# Altium project USB Dongle.PrjPcb
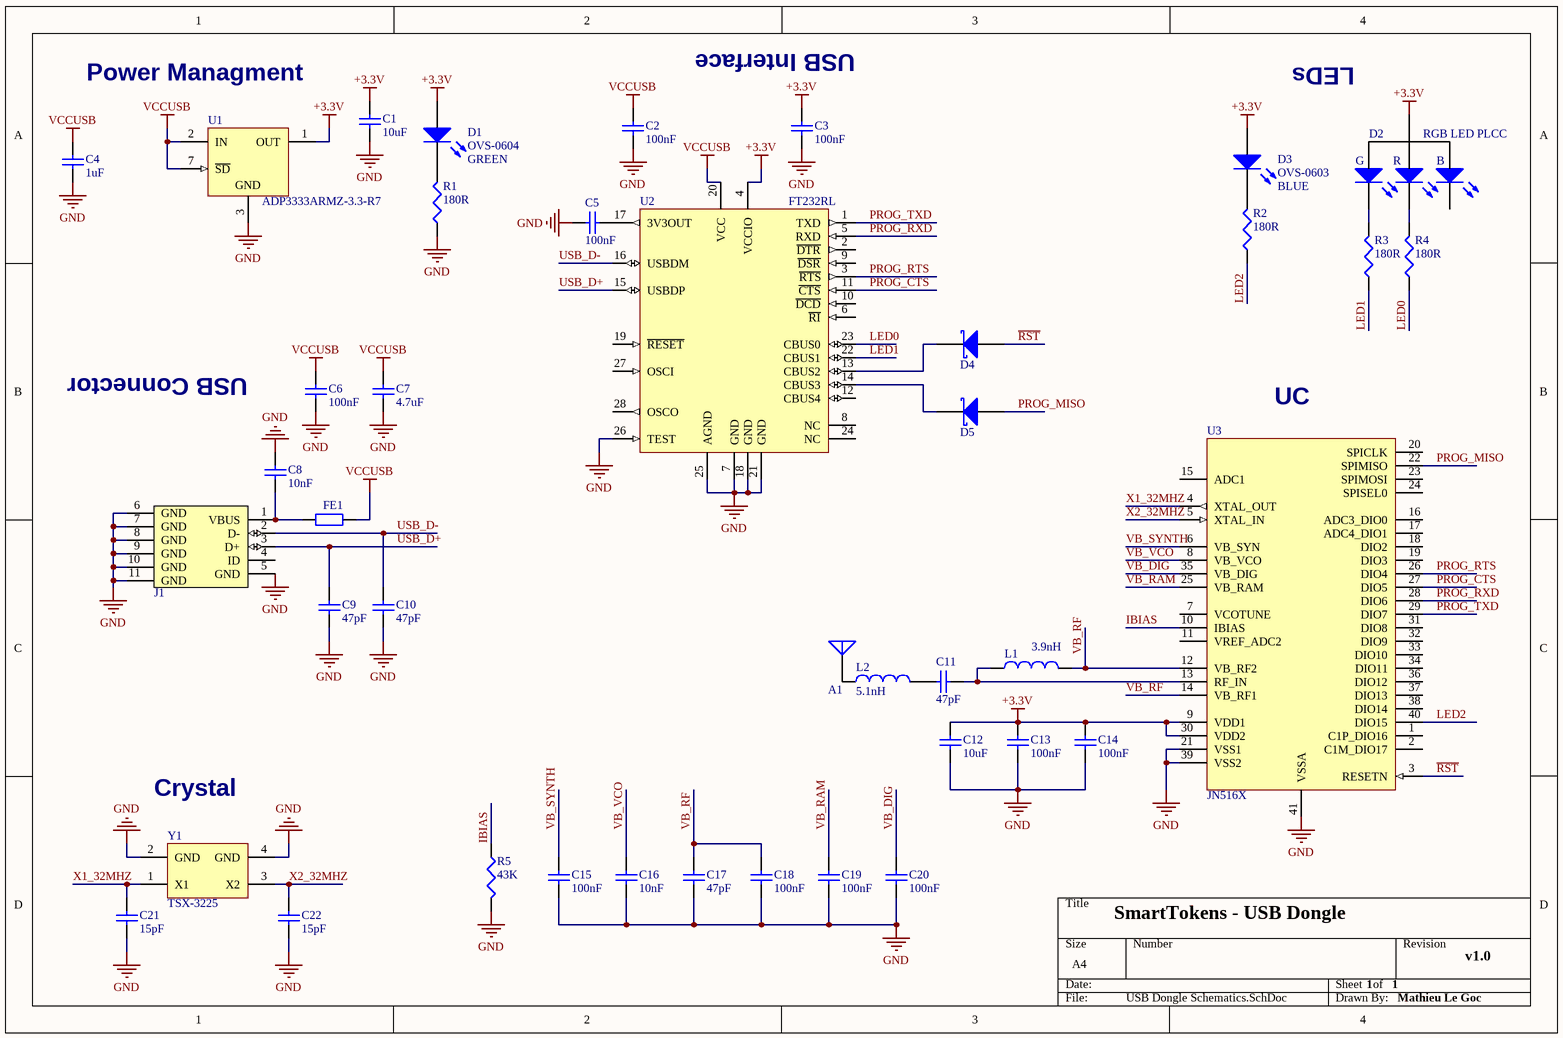
[diagram p0: USB Dongle Schematics.SchDoc]
1 sheet, 41 parts. Net scope: global (net labels, ports and power ports of the same name join across sheets).
Board file: USB Dongle PCB.PcbDoc

## Sheet USB Dongle Schematics.SchDoc: SmartTokens - USB Dongle
size A4; Author: Mathieu Le Goc; DocumentNumber: 1; Revision: v1.0; SheetNumber: 1; SheetTotal: 1; PageSetup: Record=PageOptions|CenterHorizontal=True|CenterVertical=True|PrintScale=1.04|XCorrection=1.00|YCorrection=1.00|PrintKind=1|BorderSize=5000000|LeftOffset=0|BottomOffset=0|Orientation=2|PaperLength=1000|PaperWidth=1000|Scale=100|PaperSource=7|PrintQuality=-4|MediaType=1|DitherType=10|PrintScaleMode=1|PaperKind=A4|PaperIndex=9

### Parts
A1  2450AT18A100  [2450AT18A100]  (value not drawn)
C1  value 10uF  [0603]  (hidden comment: 10uF 0603 X5R 6.3V AVX)
C2  value 100nF  [0402]  (hidden comment: 100nF 0402 X7R 16V ±10%)
C3  value 100nF  [0402]  (hidden comment: 100nF 0402 X7R 16V ±10%)
C4  value 1uF  [0603]  (hidden comment: 1uF 0603 X5R 10V MULTICOMP)
C5  value 100nF  [0402]  (hidden comment: 100nF 0402 X7R 16V ±10%)
C6  value 100nF  [0402]  (hidden comment: 100nF 0402 X7R 16V ±10%)
C7  value 4.7uF  [0603]  (hidden comment: 4.7uF 0603 X5R 10V KEMET)
C8  value 10nF  [0402]  (hidden comment: 10nF 0402 X7R 25V KEMET)
C9  value 47pF  [0402]  (hidden comment: 47pF 0402 NP0 50V MURATA)
C10  value 47pF  [0402]  (hidden comment: 47pF 0402 NP0 50V MURATA)
C11  value 47pF  [0402]  (hidden comment: 47pF 0402 NP0 50V ±5%)
C12  value 10uF  [0603]  (hidden comment: 10uF 0603 X5R 6.3V ±20%)
C13  value 100nF  [0402]  (hidden comment: 100nF 0402 X7R 16V ±10%)
C14  value 100nF  [0402]  (hidden comment: 100nF 0402 X7R 16V ±10%)
C15  value 100nF  [0402]  (hidden comment: 100nF 0402 X7R 16V ±10%)
C16  10nF  [0402]
C17  value 47pF  [0402]  (hidden comment: 47pF 0402 NP0 50V ±5%)
C18  value 100nF  [0402]  (hidden comment: 100nF 0402 X7R 16V ±10%)
C19  value 100nF  [0402]  (hidden comment: 100nF 0402 X7R 16V ±10%)
C20  value 100nF  [0402]  (hidden comment: 100nF 0402 X7R 16V ±10%)
C21  value 15pF  [0402]  (hidden comment: 15pF 0402 NP0 50V ±5%)
C22  value 15pF  [0402]  (hidden comment: 15pF 0402 NP0 50V ±5%)
D1  OVS-0604  value GREEN  [0603 - LED]
D2  RGB LED PLCC  [PLCC_4]
D3  OVS-0603  value BLUE  [0603 - LED]
D4  Schottky barrier single diode  [SOD-323]  (value not drawn)
D5  Schottky barrier single diode  [SOD-323]  (value not drawn)
FE1  MURATA - BLM18PG471SN1D  [0603]  (value not drawn)
J1  MICRO USB B  [MICRO_USB_B]  (value not drawn)
L1  value 3.9nH  [0402]  (hidden comment: 3.9NH  0402 MURATA)
L2  value 5.1nH  [0402]  (hidden comment: 5.1NH  0402 MURATA)
R1  value 180R  [0402]  (hidden comment: 180R 0402 1% VISHAY)
R2  value 180R  [0402]  (hidden comment: 180R 0402 1/16W ±1%)
R3  value 180R  [0402]  (hidden comment: 180R 0402 1/16W ±1%)
R4  value 180R  [0402]  (hidden comment: 180R 0402 1/16W ±1%)
R5  value 43K  [0402]  (hidden comment: 43K 0402 1/16W ±1%)
U1  ADP3333ARMZ-3.3-R7  [ADI-RM-8_N]
U2  FT232RL  [SSOP-28_N]
U3  JN516X  [QFN50P600X600X100_HS-41N]
Y1  TSX-3225  [TSX-3225]

### Nets
+3.3V: C1.2 C3.2 C12.2 C13.2 C14.2 D1.1(A) D2.3(A) D3.1(A) U1.1(OUT) U2.4(VCCIO) U3.9(VDD1) U3.30(VDD2)
GND: C1.1 C2.1 C3.1 C4.1 C5.2 C6.1 C7.1 C8.2 C9.1 C10.1 C12.1 C13.1 C14.1 C15.1 C16.1 C17.1 C18.1 C19.1 C20.1 C21.1 C22.1 J1.5(GND) J1.6(GND) J1.7(GND) J1.8(GND) J1.9(GND) J1.10(GND) J1.11(GND) R1.1 R5.2 U1.3(GND) U1.4(NC) U1.5(NC) U1.6(NC) U1.8(NC) U2.7(GND) U2.18(GND) U2.21(GND) U2.25(AGND) U2.26(TEST) U3.21(VSS1) U3.39(VSS2) U3.41(VSSA) Y1.2(GND) Y1.4(GND)
VCCUSB: C2.2 C4.2 C6.2 C7.2 FE1.2 U1.2(IN) U1.7(~{SD}) U2.20(VCC)
IBIAS: R5.1 U3.10(IBIAS)
LED0: R4.1 U2.23(CBUS0)
LED1: R3.1 U2.22(CBUS1)
LED2: R2.1 U3.40(DIO15)
PROG_CTS: U2.11(~{CTS}) U3.27(DIO5)
PROG_MISO: D5.2(A) U3.22(SPIMISO)
PROG_RTS: U2.3(~{RTS}) U3.26(DIO4)
PROG_RXD: U2.5(RXD) U3.28(DIO6)
PROG_TXD: U2.1(TXD) U3.29(DIO7)
~{RST}: D4.2(A) U3.3(RESETN)
USB_D+: C9.2 J1.3(D+) U2.15(USBDP)
USB_D-: C10.2 J1.2(D-) U2.16(USBDM)
VB_DIG: C20.2 U3.35(VB_DIG)
VB_RAM: C19.2 U3.25(VB_RAM)
VB_RF: C17.2 C18.2 L1.2 U3.12(VB_RF2) U3.14(VB_RF1)
VB_SYNTH: C15.2 U3.6(VB_SYN)
VB_VCO: C16.2 U3.8(VB_VCO)
X1_32MHZ: C21.2 U3.4(XTAL_OUT) Y1.1(X1)
X2_32MHZ: C22.2 U3.5(XTAL_IN) Y1.3(X2)
NetA1_1: A1.1(A) L2.1
NetC5_1: C5.1 U2.17(3V3OUT)
NetC8_1: C8.1 FE1.1 J1.1(VBUS)
NetC11_1: C11.1 L2.2
NetC11_2: C11.2 L1.1 U3.13(RF_IN)
NetD1_2: D1.2(K) R1.2
NetD2_1: D2.1(KR) R4.2
NetD2_2: D2.2(KG) R3.2
NetD3_2: D3.2(K) R2.2
NetD4_1: D4.1(K) U2.13(CBUS2)
NetD5_1: D5.1(K) U2.14(CBUS3)

Not connected (* = marked no-connect by the designer): D2 4(KB); J1 4(ID); U2 2(~{DTR}) 6(~{RI}) 8(NC) 9(~{DSR}) 10(~{DCD}) 12(CBUS4) 19(~{RESET}) 24(NC) 27(OSCI) 28(OSCO); U3 1(C1P_DIO16) 2(C1M_DIO17) 7(VCOTUNE) 11(VREF_ADC2) 15(ADC1) 16(ADC3_DIO0) 17(ADC4_DIO1) 18(DIO2) 19(DIO3) 20(SPICLK) 23(SPIMOSI) 24(SPISEL0) 31(DIO8) 32(DIO9) 33(DIO10) 34(DIO11) 36(DIO12) 37(DIO13) 38(DIO14)

### Notes on the sheet
- (near C3) USB Interface
- Power Managment
- LEDs
- USB Connector
- (near U3) UC
- Crystal
- (in symbol RGB_LED) G; R; B

### Library data of the parts
A1 = 2450AT18A100: JOHANSON TECHNOLOGY  2450AT18A100E  ANTENNA, CERAMIC, 2.45GHZ; Supplier 1: Farnell; Supplier Part Number 1: 1885496; Supplier 2: Digi-Key; Supplier Part Number 2: 712-1005-1-ND
C1 = 10uF 0603 X5R 6.3V: AVX - 06036D106MAT2A - 0603 X5R 6.3V 10UF; Supplier 1: Farnell; Supplier Part Number 1: 1833804
C2 C3 C5 C6 C13-C15 C18-C20 = 100nF (cheap): Supplier 1: Farnell; Supplier Part Number 1: 1288252; Supplier 2: Digi-Key; Supplier Part Number 2: 399-3521-1-ND
C4 = 1uF 0603 X5R 10V: MULTICOMP - MC0603X105K100CT - MLCC 0603 X5R 10V 1UF; Supplier 1: Farnell; Supplier Part Number 1: 1759399
C7 = 4.7uF 0603 X5R 10V: KEMET - C0603C475K8PACTU - CONDENSATEUR 4.7UF 10V X5R 0603; Supplier 1: Farnell; Supplier Part Number 1: 1572625
C8 = 10nF 0402 X7R 25V: KEMET - C0402C103J3RACTU - MLCC 0402 25V 0.01UF; Supplier 1: Farnell; Supplier Part Number 1: 1692285
C9 C10 = 47pF 0402 NP0 50V: MURATA - GRM1555C1H470JZ01D - 0402 47PF 50V; Supplier 1: Farnell; Supplier Part Number 1: 8819670
C11 C17 = 47pF: Supplier 1: Farnell; Supplier Part Number 1: 8819670; Supplier 2: Digi-Key; Supplier Part Number 2: 445-1243-1-ND
C12 = 10uF (cheap): Supplier 1: Farnell; Supplier Part Number 1: 1833804; Supplier 2: Digi-Key; Supplier Part Number 2: 478-5318-1-ND
C16 = 10nF: 10nF 0402 X7R 25V ±5%; Supplier 1: Farnell; Supplier Part Number 1: 1692285; Supplier 2: Digi-Key; Supplier Part Number 2: 399-1279-1-ND; Value: 10nF
C21 C22 = 15pF: Supplier 1: Farnell; Supplier Part Number 1: 1414577; Supplier 2: Digi-Key; Supplier Part Number 2: 399-1014-1-ND
D1 = LED GREEN: MULTICOMP - OVS-0604 - LED, 0603, GREEN, 300MCD, 520NM; Supplier 1: Farnell; Supplier Part Number 1: 1716771
D2 = RGB_LED: MULTICOMP - 703-1028 - LED RGB 3528 PLCC; Supplier 1: Farnell; Supplier Part Number 1: 2112143
D3 = LED BLUE: MULTICOMP - OVS-0603 - LED 0603 SUPER BRIGHT BLUE; Supplier 1: Farnell; Supplier Part Number 1: 1716770
D4 D5 = 1PS76SB10: NXP - 1PS76SB10; Supplier 1: Farnell; Supplier Part Number 1: 1081179
FE1 = FERRITE: Ferrite Bead (470R ~ 100MHz); Supplier 1: Farnell; Supplier Part Number 1: 1515745
J1 = MICRO_USB_B: MOLEX - 47346-0001 - FEMALE MICRO USB B BOTTOM MOUNT; Supplier 1: Farnell; Supplier Part Number 1: 1568026
L1 = 3.9NH 0402 ±0.1NH: MURATA - LQP15MN3N9B02D - 3.9NH ±0.1NH 0402; Supplier 1: Digi-Key; Supplier Part Number 1: 490-1131-1-ND
L2 = 5.1NH 0402 ±0.1NH: MURATA - LQP15MN5N1B02D - 5.1NH ±0.1NH 0402; Supplier 1: Digi-Key; Supplier Part Number 1: 490-6758-1-ND
R1 = 180R 0402 1%: VISHAY DRALORIC - CRCW0402180RFKED - 0402 180R 1%; Supplier 1: Farnell; Supplier Part Number 1: 2140698
R2-R4 = 180R: Supplier 1: Farnell; Supplier Part Number 1: 2140698; Supplier 2: Digi-Key; Supplier Part Number 2: 541-180LCT-ND
R5 = 43K: Supplier 1: Farnell; Supplier Part Number 1: 1358086; Supplier 2: Digi-Key; Supplier Part Number 2: 541-43.0KLCT-ND
U1 = ADP3333ARMZ-3.3-R7: High Accuracy Ultralow IQ, 300 mA, anyCAP Low Dropout Regulator, 2.6 to 12 V Vin, 3.3 V Vout, Industrial, 8-pin SOP (RM-8), Reel; Manufacturer: Analog Devices; Iout max: 300mA; Preset Vout Values (V): 3.3; Supply Current IGND @ Small Load: 70uA; Vin (max) (V): 12; Vin (min) (V): 2.6; DatasheetVersion: Rev. B; PackageVersion: Aug-05; PackageReference: RM-8; PackageDescription: 8-Pin Mini Small Outline Package, Body 3 x 3 mm, Pitch 0.65 mm; Supplier 1: Digi-Key; Supplier Part Number 1: ADP3333ARMZ-3.3-R7TR-ND; Supplier 2: Digi-Key; Supplier Part Number 2: ADP3333ARMZ-3.3-R7CT-ND; Supplier 3: Digi-Key; Supplier Part Number 3: ADP3333ARMZ-3.3-R7DKR-ND; Supplier 4: Farnell; Supplier Part Number 4: 2074872; Supplier 5: Farnell; Supplier Part Number 5: 2074872RL; Supplier 6: Newark; Supplier Part Number 6: 61M3992; Supplier 7: Newark; Supplier Part Number 7: 67W2712; Supplier 8: Mouser; Supplier Part Number 8: 584-ADP3333ARMZ3.3R7; Packing: Reel; Mounting Technology: Surface Mount; Code_JEDEC: MO-187-AA; PartNumber: ADP3333ARMZ-3.3-R7; ComponentLink1Description: Manufacturer URL; ComponentLink1URL: http://www.analog.com/en/index.html; ComponentLink2Description: Datasheet; ComponentLink2URL: http://www.analog.com/static/imported-files/data_sheets/ADP3333.pdf; ComponentLink3Description: Package Specification; ComponentLink3URL: http://www.analog.com/static/imported-files/packages/PKG_PDF/MSOP%28RM%29/RM_8.pdf; ComponentLink4Description: URL Link1; ComponentLink4URL: Product URL:http://www.analog.com/en/ADP3333/productSearch.html
U2 = FT232RL: USB UART Asynchronous Serial Data Transfer Chip, SSOP-28, Tape and Reel; Published: 19-Aug-2010; DatasheetVersion: ver 2.07, Jul-2010; PackageVersion: 2010; PackageReference: SSOP-28; Publisher: Altium Limited; PackageDescription: 28-Pin Small Outline Package 0.65 mm Pitch; ComponentLink1Description: Manufacturer Link; ComponentLink1URL: http://www.ftdichip.com/Products/ICs/FT232R.htm; ComponentLink2Description: Datasheet; ComponentLink2URL: http://www.ftdichip.com/Support/Documents/DataSheets/ICs/DS_FT232R.pdf; Supplier 1: Farnell; Supplier Part Number 1: 1146032
U3 = JN516X: IEEE802.15.4 Wireless Microcontroller; Supplier 1: Farnell; Supplier Part Number 1: 2341782
Y1 = TSX-3225: EPSON - TSX-3225, 32MHZ, 10PPM, 9PF - CRYSTAL, TSX-3225, 32MHZ, 10PPM, 9PF; Supplier 1: Farnell; Supplier Part Number 1: 1712845